# EAGLE schematic MCAT-CANYVAL-BPL-5X1 (EAGLE 7.2.0)
DATECODE: 20150302102847; REV: 5X
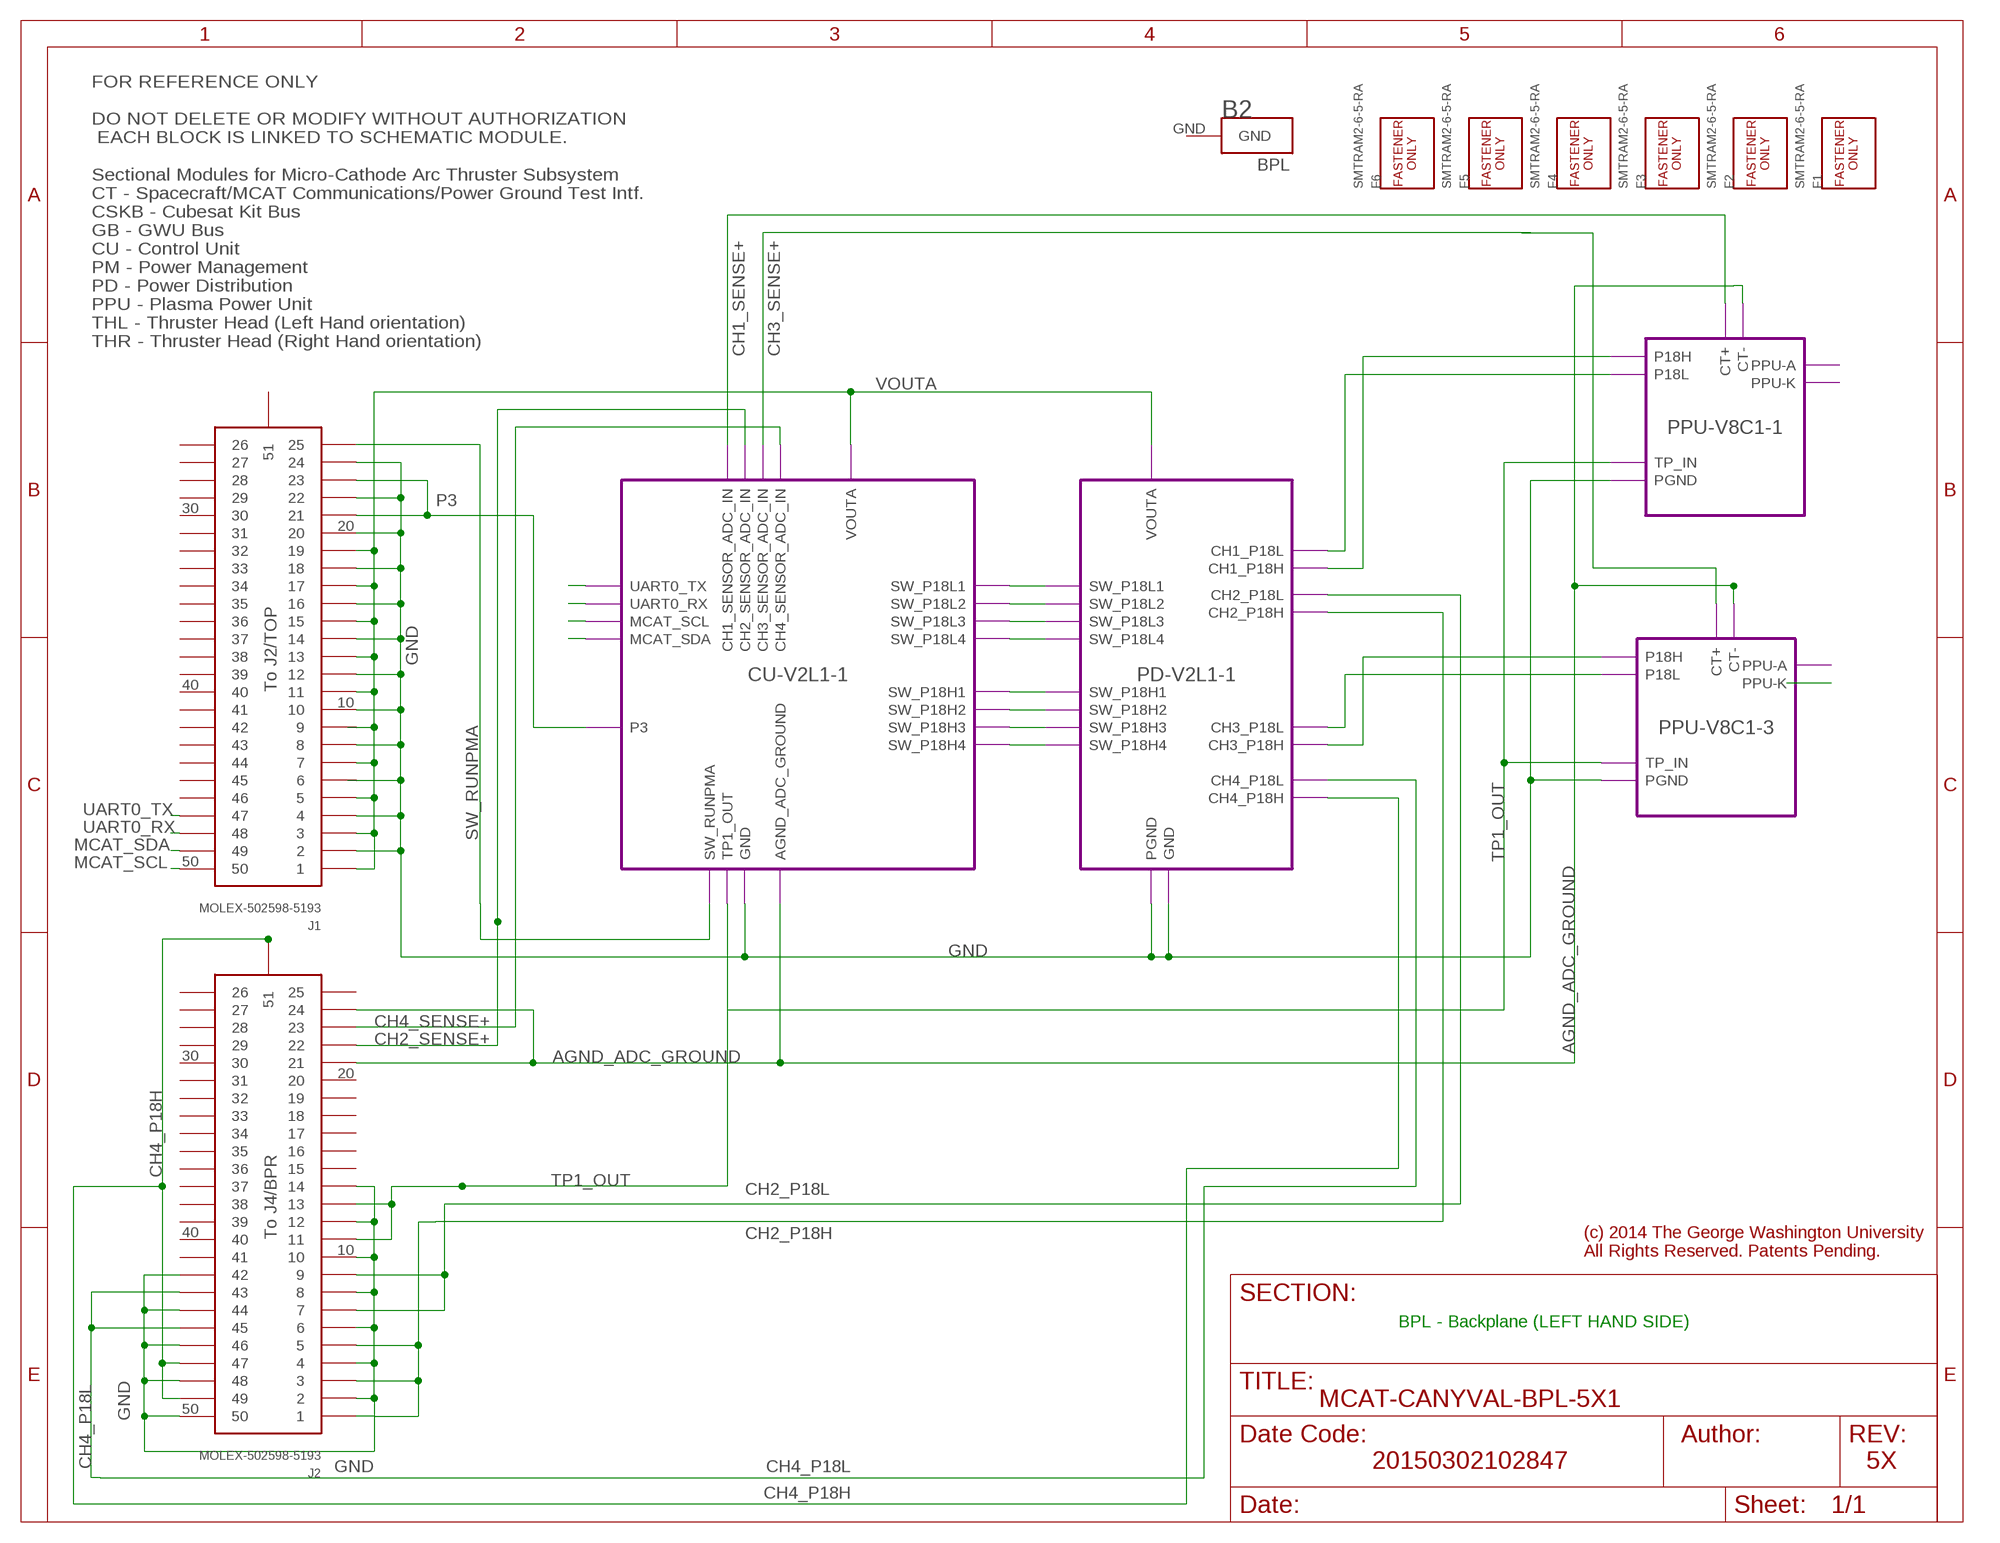
[diagram p0: schematic, sheet 1]

## Parts
B2  MCAT-4CU-C-PCB/BPL  [MCAT-4CU-C-BPL-V4-BLANK]
F1  SMTRAM2-6-5-RA  [SMTRA-M2-6-5-RA]
F2  SMTRAM2-6-5-RA  [SMTRA-M2-6-5-RA]
F3  SMTRAM2-6-5-RA  [SMTRA-M2-6-5-RA]
F4  SMTRAM2-6-5-RA  [SMTRA-M2-6-5-RA]
F5  SMTRAM2-6-5-RA  [SMTRA-M2-6-5-RA]
F6  SMTRAM2-6-5-RA  [SMTRA-M2-6-5-RA]
J1  MOLEX-502598-5193  [MOLEX-502598-5193]
J2  MOLEX-502598-5193  [MOLEX-502598-5193]

## Module instances
PD-V2L1-1 = PD-V2L1
CU-V2L1-1 = CU-V2L2
PPU-V8C1-1 = PPU-V8C1
PPU-V8C1-3 = PPU-V8C1

## Nets
AGND_ADC_GROUND: J2.21 J2.24 ; port PPU-V8C1-1.CT- PPU-V8C1-3.CT- CU-V2L1-1.AGND_ADC_GROUND
CH1_P18H [P18H-0.6A-CKT]: port PD-V2L1-1.CH1_P18H PPU-V8C1-1.P18H
CH1_P18L: port PD-V2L1-1.CH1_P18L PPU-V8C1-1.P18L
CH1_SENSE+: port PPU-V8C1-1.CT+ CU-V2L1-1.CH1_SENSOR_ADC_IN
CH2_P18H [P18H-0.6A-CKT]: J2.1 J2.3 J2.5 ; port PD-V2L1-1.CH2_P18H
CH2_P18L: J2.7 J2.9 ; port PD-V2L1-1.CH2_P18L
CH2_SENSE+: J2.22 ; port CU-V2L1-1.CH2_SENSOR_ADC_IN
CH3_P18H [P18H-0.6A-CKT]: port PD-V2L1-1.CH3_P18H PPU-V8C1-3.P18H
CH3_P18L: port PD-V2L1-1.CH3_P18L PPU-V8C1-3.P18L
CH3_SENSE+: port CU-V2L1-1.CH3_SENSOR_ADC_IN PPU-V8C1-3.CT+
CH4_P18H: J2.47 J2.49 J2.51 ; port PD-V2L1-1.CH4_P18H
CH4_P18L: J2.43 J2.45 ; port PD-V2L1-1.CH4_P18L
CH4_SENSE+: J2.23 ; port CU-V2L1-1.CH4_SENSOR_ADC_IN
CH13_PPU_K: port PPU-V8C1-3.PPU-K
GND: J1.2 J1.4 J1.8 J1.10 J1.12 J1.14 J1.16 J1.18 J1.20 J1.22 J1.24 J2.2 J2.4 J2.6 J2.8 J2.10 J2.12 J2.14 J2.42 J2.44 J2.46 J2.48 J2.50 ; port PD-V2L1-1.GND PD-V2L1-1.PGND PPU-V8C1-1.PGND PPU-V8C1-3.PGND CU-V2L1-1.GND
MCAT_SCL: J1.50 ; port CU-V2L1-1.MCAT_SCL
MCAT_SDA: J1.49 ; port CU-V2L1-1.MCAT_SDA
N$3: port PPU-V8C1-1.PPU-K
N$24: port CU-V2L1-1.SW_P18H3 PD-V2L1-1.SW_P18H3
P3 [P3-0.5A-CKT]: J1.21 J1.23 ; port CU-V2L1-1.P3
SW_P18H1: port CU-V2L1-1.SW_P18H1 PD-V2L1-1.SW_P18H1
SW_P18H3: port CU-V2L1-1.SW_P18H2 PD-V2L1-1.SW_P18H2
SW_P18H4: port CU-V2L1-1.SW_P18H4 PD-V2L1-1.SW_P18H4
SW_P18L: port CU-V2L1-1.SW_P18L1 PD-V2L1-1.SW_P18L1
SW_P18L2: port CU-V2L1-1.SW_P18L2 PD-V2L1-1.SW_P18L2
SW_P18L3: port CU-V2L1-1.SW_P18L3 PD-V2L1-1.SW_P18L3
SW_P18L4: port CU-V2L1-1.SW_P18L4 PD-V2L1-1.SW_P18L4
SW_RUNPMA: J1.25 ; port CU-V2L1-1.SW_RUNPMA
TP1_OUT [P18H-0.6A-CKT]: J2.11 J2.13 ; port CU-V2L1-1.TP1_OUT PPU-V8C1-3.TP_IN PPU-V8C1-1.TP_IN
UART0_RX: J1.48 ; port CU-V2L1-1.UART0_RX
UART0_TX: J1.47 ; port CU-V2L1-1.UART0_TX
VOUTA [VOUTA-2A-CKT]: J1.1 J1.3 J1.5 J1.7 J1.11 J1.13 J1.15 J1.17 J1.19 ; port PD-V2L1-1.VOUTA CU-V2L1-1.VOUTA
Unconnected: B2.GND J1.6 J1.9 J1.26 J1.27 J1.28 J1.29 J1.30 J1.31 J1.32 J1.33 J1.34 J1.35 J1.36 J1.37 J1.38 J1.39 J1.40 J1.41 J1.42 J1.43 J1.44 J1.45 J1.46 J1.51 J2.15 J2.16 J2.17 J2.18 J2.19 J2.20 J2.25 J2.26 J2.27 J2.28 J2.29 J2.30 J2.31 J2.32 J2.33 J2.34 J2.35 J2.36 J2.37 J2.38 J2.39 J2.40 J2.41

## Notes on the sheet
- FOR REFERENCE ONLY
  
  DO NOT DELETE OR MODIFY WITHOUT AUTHORIZATION
   EACH BLOCK IS LINKED TO SCHEMATIC MODULE.
  
  Sectional Modules for Micro-Cathode Arc Thruster Subsystem
  CT - Spacecraft/MCAT Communications/Power Ground Test Intf.
  CSKB - Cubesat Kit Bus
  GB - GWU Bus
  CU - Control Unit
  PM - Power Management
  PD - Power Distribution
  PPU - Plasma Power Unit
  THL - Thruster Head (Left Hand orientation)
  THR - Thruster Head (Right Hand orientation)
- To J2/TOP
- To J4/BPR
- BPL - Backplane (LEFT HAND SIDE)

## Library data of the parts
B2 = gwu_mpnl_ucat_v10:MCAT-4CU-C-PCB; COPYRIGHT: (c) 2015, The George Washington University. All Rights Reserved.; PCBLABEL: BPL
F1-F6 = gwu_mpnl_ucat_v10:SMTRA: Type SMTRA - ReelFast Surface Mount Right Angle (R'ANGLE) Fastener (Metric); MF: PENNEngineering; MPN: SMTRAM2-6-5ET
J1 J2 = gwu_mpnl_ucat_v10:MOLEX-502598-5193: MOLEX 0.3MM PITCH FPC CONN MALE 51 CKTS MOLEX 502598-5193 based upon SD-502598-003 (2012/08/01); MF: MOLEX; MPN: 502598-5193

## Module CU-V2L2
Ports: GND(pwr) P3(in) UART0_TX(out) UART0_RX(in) SW_RUNPMA(out) TP1_OUT(out) SW_P18L1(out) SW_P18L2(out) SW_P18L3(out) SW_P18L4(out) SW_P18H1(out) SW_P18H2(out) SW_P18H3(out) SW_P18H4(out) CH1_SENSOR_ADC_IN(io) CH2_SENSOR_ADC_IN(io) CH3_SENSOR_ADC_IN(io) CH4_SENSOR_ADC_IN(io) AGND_ADC_GROUND(io) MCAT_SCL(io) MCAT_SDA(io) VOUTA(io)
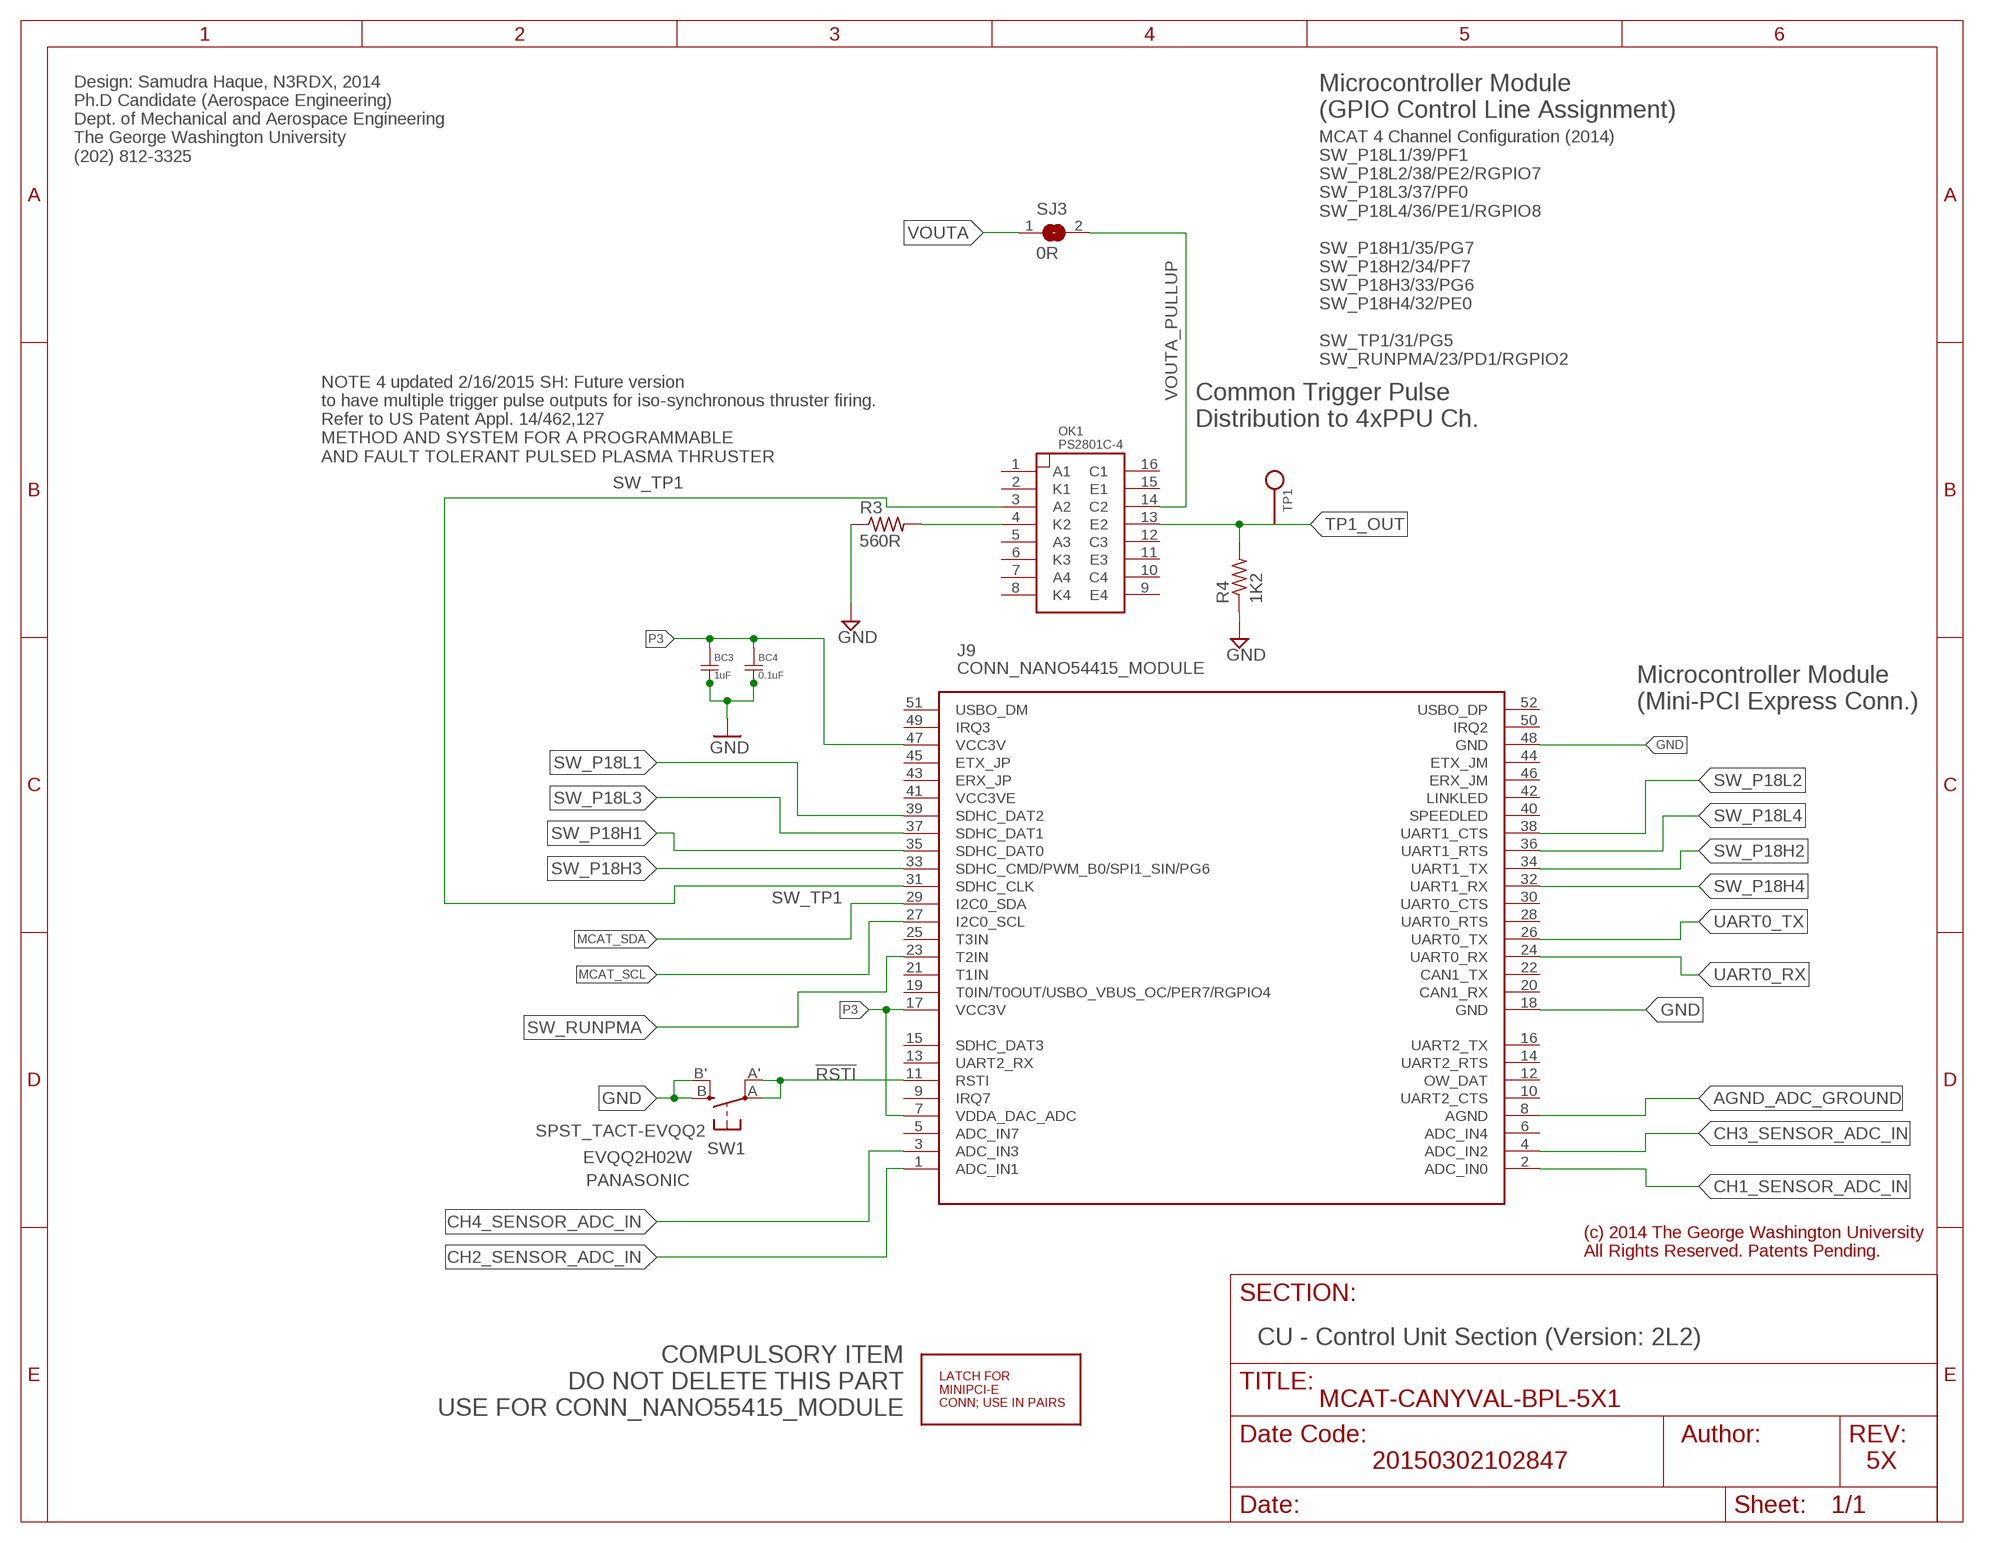
[diagram p1: schematic, module CU-V2L2, sheet 1]

### Parts
BC3  BYPASS-CAP-1UF  [0612-REV]
BC4  BYPASS-CAP-0.1UF  [0612-REV]
J7  LATCH_NANO54415_MODULE  [LATCH_SD-48099-400]
J9  CONN_NANO54415_MODULE  [CONN_SD-67910-001]
OK1  PS2801C-4  [SSOP(16PIN)]
R3  560R  R-US_R0805  [R0805]
R4  1K2  R-US_R0805  [R0805]
SJ3  0R  SJ  [SJ]
SW1  SPST_TACT-EVQQ2  [EVQ-Q2]
TP1  PCB-MINI-SMD-TESTPOINT/SQ  [PCB-MINI-SMD-TESTPOINT]

### Nets
!RSTI: J9.11(RSTI) SW1.A'(P1) SW1.A(P)
AGND_ADC_GROUND: J9.8(AGND)
CH1_SENSOR_ADC_IN: J9.2(ADC_IN0)
CH2_SENSOR_ADC_IN: J9.1(ADC_IN1)
CH3_SENSOR_ADC_IN: J9.4(ADC_IN2)
CH4_SENSOR_ADC_IN: J9.3(ADC_IN3)
GND: BC3.2 BC4.2 J9.18(GND) J9.48(GND) R3.1 R4.1 SW1.B'(S1) SW1.B(S)
MCAT_SCL: J9.27(I2C0_SCL)
MCAT_SDA: J9.29(I2C0_SDA)
P3 [P3-0.5A-CKT]: BC3.1 BC4.1 J9.7(VDDA_DAC_ADC) J9.17(VCC3V) J9.47(VCC3V)
SW1_TP1_RTN: OK1.4(K2) R3.2
SW_P18H1: J9.35(SDHC_DAT0)
SW_P18H2: J9.34(UART1_TX)
SW_P18H3: J9.33(SDHC_CMD/PWM_B0/SPI1_SIN/PG6)
SW_P18H4: J9.32(UART1_RX)
SW_P18L1: J9.39(SDHC_DAT2)
SW_P18L2: J9.38(UART1_CTS)
SW_P18L3: J9.37(SDHC_DAT1)
SW_P18L4: J9.36(UART1_RTS)
SW_RUNPMA: J9.23(T2IN)
SW_TP1: J9.31(SDHC_CLK) OK1.3(A2)
TP1_OUT [P18H-0.6A-CKT]: OK1.13(E2) R4.2 TP1.1(TP)
UART0_RX: J9.24(UART0_RX)
UART0_TX: J9.26(UART0_TX)
VOUTA [power]: SJ3.1
VOUTA_PULLUP [P18H-0.6A-CKT]: OK1.14(C2) SJ3.2
Unconnected: J9.5(ADC_IN7) J9.6(ADC_IN4) J9.9(IRQ7) J9.10(UART2_CTS) J9.12(OW_DAT) J9.13(UART2_RX) J9.14(UART2_RTS) J9.15(SDHC_DAT3) J9.16(UART2_TX) J9.19(T0IN/T0OUT/USBO_VBUS_OC/PER7/RGPIO4) J9.20(CAN1_RX) J9.21(T1IN) J9.22(CAN1_TX) J9.25(T3IN) J9.28(UART0_RTS) J9.30(UART0_CTS) J9.40(SPEEDLED) J9.41(VCC3VE) J9.42(LINKLED) J9.43(ERX_JP) J9.44(ETX_JM) J9.45(ETX_JP) J9.46(ERX_JM) J9.49(IRQ3) J9.50(IRQ2) J9.51(USBO_DM) J9.52(USBO_DP) OK1.1(A1) OK1.2(K1) OK1.5(A3) OK1.6(K3) OK1.7(A4) OK1.8(K4) OK1.9(E4) OK1.10(C4) OK1.11(E3) OK1.12(C3) OK1.15(E1) OK1.16(C1)

### Notes on the sheet
- Microcontroller Module
  (GPIO Control Line Assignment)
- Design: Samudra Haque, N3RDX, 2014
  Ph.D Candidate (Aerospace Engineering)
  Dept. of Mechanical and Aerospace Engineering
  The George Washington University
  (202) 812-3325
- MCAT 4 Channel Configuration (2014)
  SW_P18L1/39/PF1
  SW_P18L2/38/PE2/RGPIO7
  SW_P18L3/37/PF0
  SW_P18L4/36/PE1/RGPIO8
  
  SW_P18H1/35/PG7
  SW_P18H2/34/PF7
  SW_P18H3/33/PG6
  SW_P18H4/32/PE0
  
  SW_TP1/31/PG5
  SW_RUNPMA/23/PD1/RGPIO2
- Common Trigger Pulse
  Distribution to 4xPPU Ch.
- NOTE 4 updated 2/16/2015 SH: Future version
  to have multiple trigger pulse outputs for iso-synchronous thruster firing. 
  Refer to US Patent Appl. 14/462,127 
  METHOD AND SYSTEM FOR A PROGRAMMABLE 
  AND FAULT TOLERANT PULSED PLASMA THRUSTER
- Microcontroller Module
  (Mini-PCI Express Conn.)
- CU - Control Unit Section (Version: 2L2)
- COMPULSORY ITEM
  DO NOT DELETE THIS PART
  USE FOR CONN_NANO55415_MODULE

### Library data of the parts
BC3 = gwu_mpnl_ucat_v10:BYPASS-CAP-1UF; MF: AVX; MPN: 0612YC105KAT2A
BC4 = gwu_mpnl_ucat_v10:BYPASS-CAP-0.1UF; MF: AVX; MPN: 06123C104KAT2A
J7 = gwu_mpnl_ucat_v10:LATCH_NANO54415_MODULE; MF: MOLEX; MPN: SD-48099-400
J9 = gwu_mpnl_ucat_v10:CONN_NANO54415_MODULE; MF: MOLEX; MPN: SD-679101-002
OK1 = gwu_mpnl_ucat_v10:PS2801C-4; MF: CEL/California Eastern Laboratories; MPN: PS2801C-4-F3-A
R3 = resistor:R-US_: RESISTOR, American symbol; MF: PANASONIC; MPN: ERA-6AEB561V
R4 = resistor:R-US_: RESISTOR, American symbol; MF: PANASONIC; MPN: ERA-6AEB122V
SJ3 = jumper:SJ: SMD solder JUMPER; MF: VISHAY/DALE; MPN: CRCW08050000Z0EA
SW1 = adafruit:SPST_TACT: SMT 6mm switch, EVQQ2 series http://www.ladyada.net/library/eagle; MF: PANASONIC; MPN: EVQQ2H02W
TP1 = gwu_mpnl_ucat_v10:PCB-MINI-SMD-TESTPOINT; MF: Keystone Electronics; MPN: 5015

## Module PD-V2L1
Ports: VOUTA(in) GND(pwr) SW_P18L1(in) SW_P18L2(in) SW_P18L3(in) SW_P18L4(in) SW_P18H1(in) SW_P18H2(in) SW_P18H3(in) SW_P18H4(in) CH1_P18L(out) CH1_P18H(out) CH2_P18L(out) CH2_P18H(out) CH3_P18L(out) CH3_P18H(out) CH4_P18L(out) CH4_P18H(out) PGND(pwr)
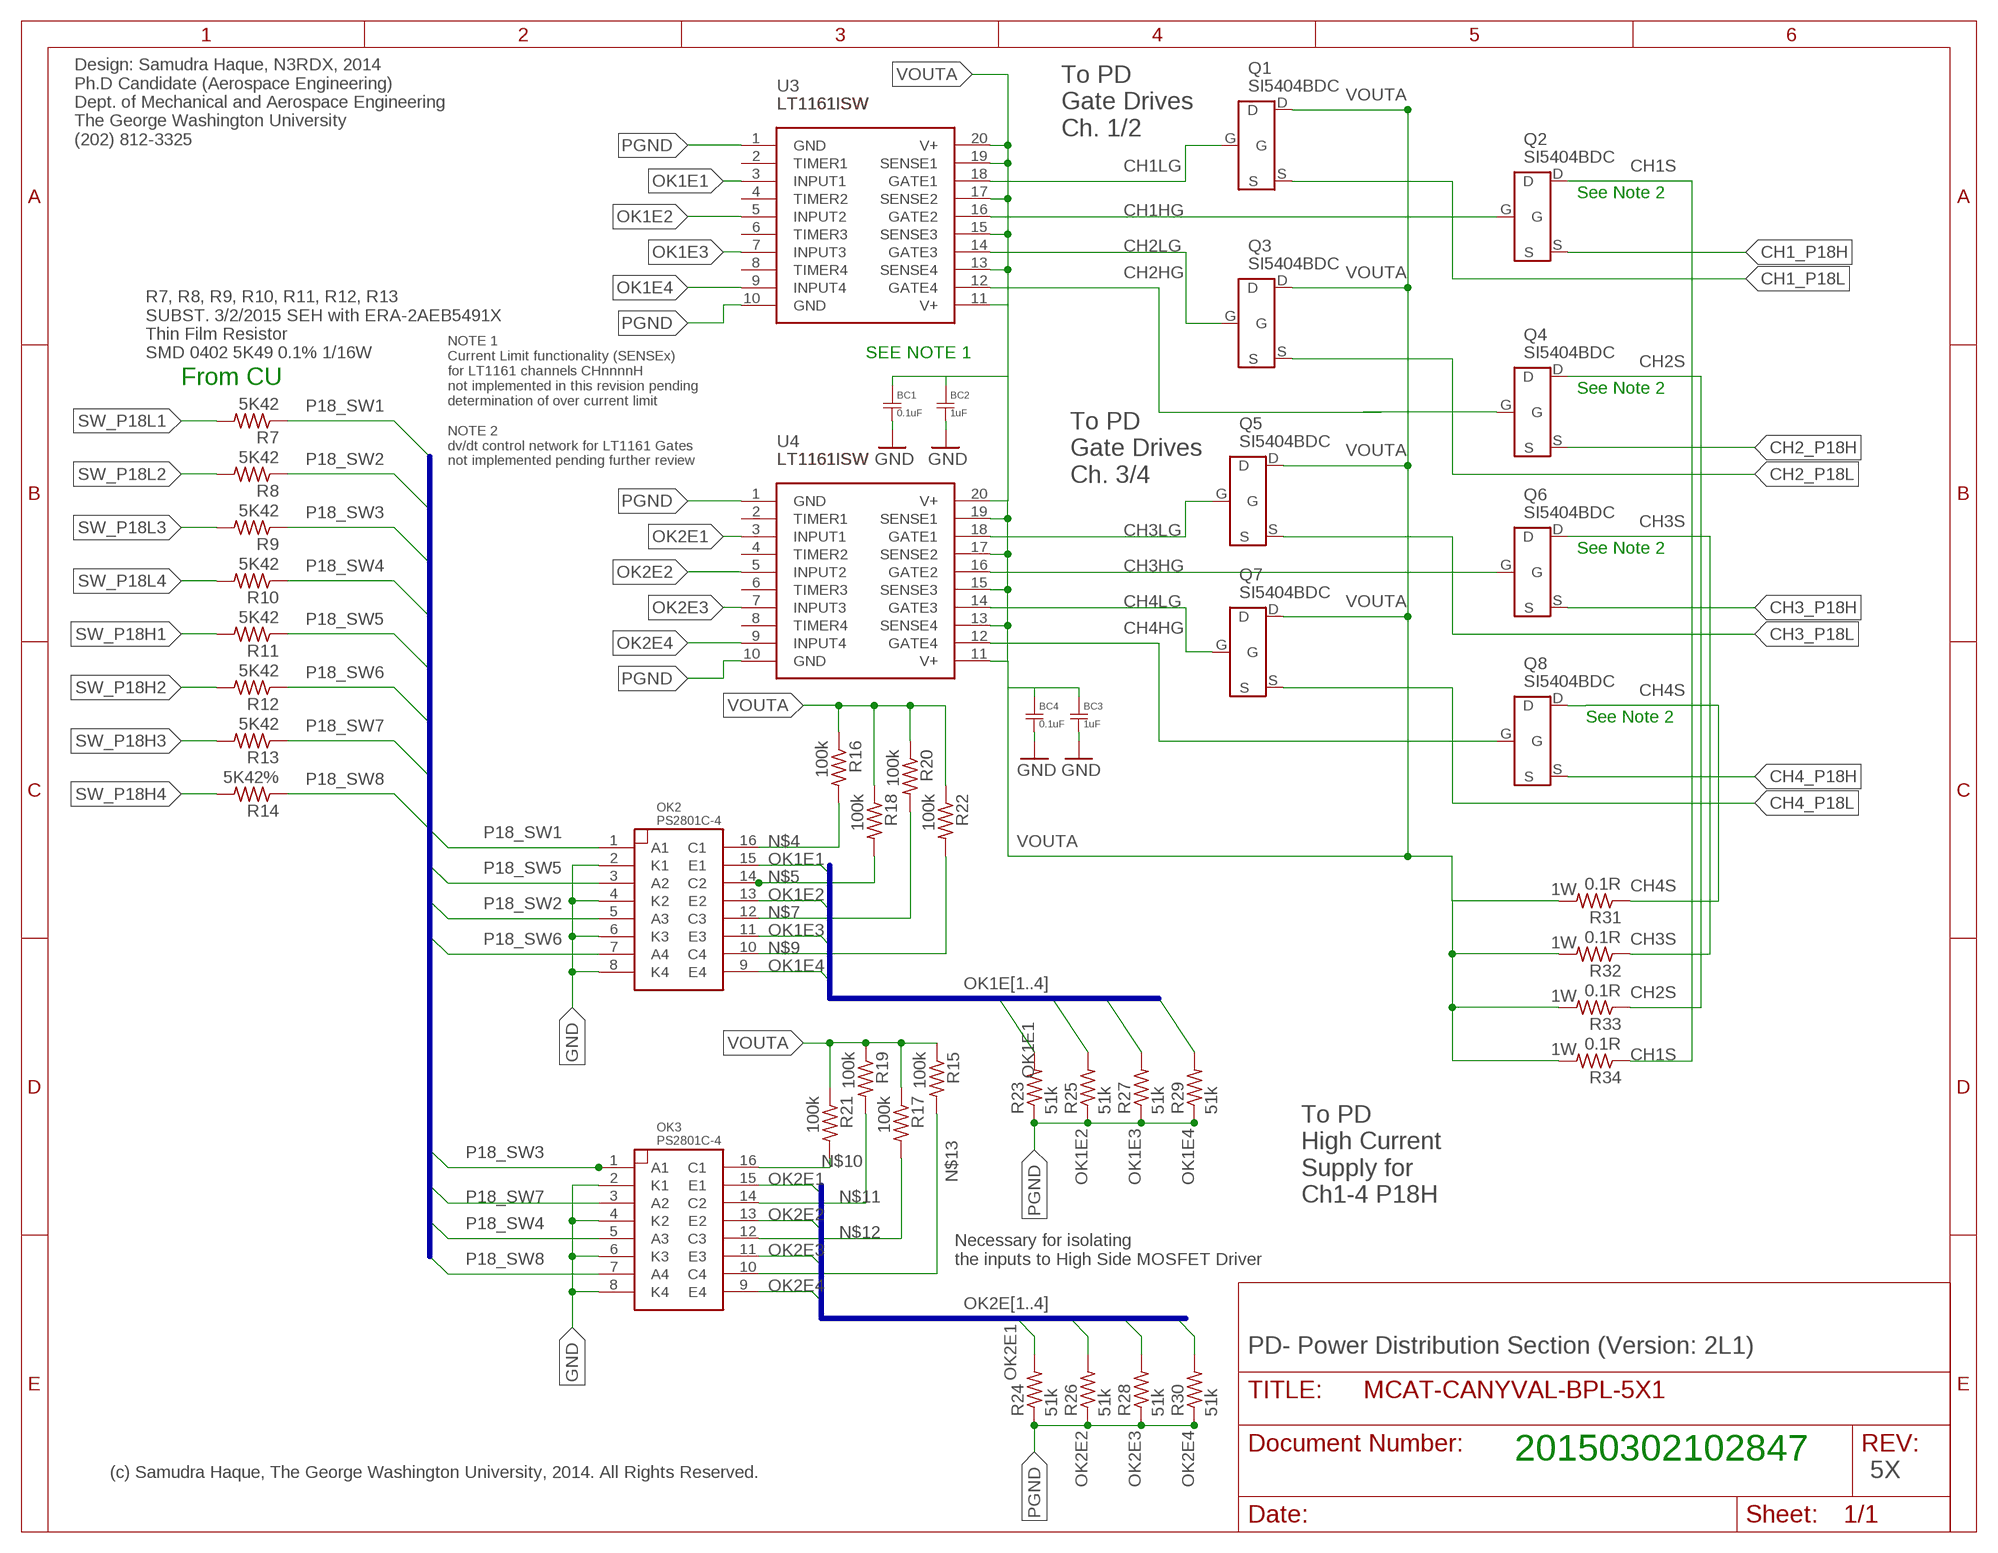
[diagram p2: schematic, module PD-V2L1, sheet 1]

### Parts
BC1  BYPASS-CAP-0.1UF  [0612-REV]
BC2  BYPASS-CAP-1UF  [0612-REV]
BC3  BYPASS-CAP-1UF  [0612-REV]
BC4  BYPASS-CAP-0.1UF  [0612-REV]
OK2  PS2801C-4  [SSOP(16PIN)]
OK3  PS2801C-4  [SSOP(16PIN)]
Q1  SI5404BDC  [1206-8-CHIPFET]
Q2  SI5404BDC  [1206-8-CHIPFET]
Q3  SI5404BDC  [1206-8-CHIPFET]
Q4  SI5404BDC  [1206-8-CHIPFET]
Q5  SI5404BDC  [1206-8-CHIPFET]
Q6  SI5404BDC  [1206-8-CHIPFET]
Q7  SI5404BDC  [1206-8-CHIPFET]
Q8  SI5404BDC  [1206-8-CHIPFET]
R7  5K42  R-US_R0402  [R0402]
R8  5K42  R-US_R0402  [R0402]
R9  5K42  R-US_R0402  [R0402]
R10  5K42  R-US_R0402  [R0402]
R11  5K42  R-US_R0402  [R0402]
R12  5K42  R-US_R0402  [R0402]
R13  5K42  R-US_R0402  [R0402]
R14  5K42%  R-US_R0402  [R0402]
R15  100k  R-US_R0402  [R0402]
R16  100k  R-US_R0402  [R0402]
R17  100k  R-US_R0402  [R0402]
R18  100k  R-US_R0402  [R0402]
R19  100k  R-US_R0402  [R0402]
R20  100k  R-US_R0402  [R0402]
R21  100k  R-US_R0402  [R0402]
R22  100k  R-US_R0402  [R0402]
R23  51k  R-US_R0402  [R0402]
R24  51k  R-US_R0402  [R0402]
R25  51k  R-US_R0402  [R0402]
R26  51k  R-US_R0402  [R0402]
R27  51k  R-US_R0402  [R0402]
R28  51k  R-US_R0402  [R0402]
R29  51k  R-US_R0402  [R0402]
R30  51k  R-US_R0402  [R0402]
R31  0.1R  R-US_R1206  [R1206]
R32  0.1R  R-US_R1206  [R1206]
R33  0.1R  R-US_R1206  [R1206]
R34  0.1R  R-US_R1206  [R1206]
U3  LT1161ISW  [20-LEAD-PLASTIC-SO]
U4  LT1161ISW  [20-LEAD-PLASTIC-SO]

### Nets
CH1_P18H [power]: Q2.S
CH1_P18L: Q1.S
CH1HG: Q2.G U3.16(GATE2)
CH1LG: Q1.G U3.18(GATE1)
CH1S: Q2.D R34.1
CH2_P18H [power]: Q4.S
CH2_P18L: Q3.S
CH2HG: Q4.G U3.12(GATE4)
CH2LG: Q3.G U3.14(GATE3)
CH2S: Q4.D R33.1
CH3_P18H [power]: Q6.S
CH3_P18L: Q5.S
CH3HG: Q6.G U4.16(GATE2)
CH3LG: Q5.G U4.18(GATE1)
CH3S: Q6.D R32.1
CH4_P18H [power]: Q8.S
CH4_P18L: Q7.S
CH4HG: Q8.G U4.12(GATE4)
CH4LG: Q7.G U4.14(GATE3)
CH4S: Q8.D R31.1
GND: BC1.2 BC2.2 BC3.2 BC4.2 OK2.2(K1) OK2.4(K2) OK2.6(K3) OK2.8(K4) OK3.2(K1) OK3.4(K2) OK3.6(K3) OK3.8(K4)
N$4: OK2.16(C1) R16.2
N$5: OK2.14(C2) R18.2
N$7: OK2.12(C3) R20.2
N$9: OK2.10(C4) R22.2
N$10: OK3.16(C1) R21.2
N$11: OK3.14(C2) R19.2
N$12: OK3.12(C3) R17.2
N$13: OK3.10(C4) R15.2
OK1E1: OK2.15(E1) R23.2 U3.3(INPUT1)
OK1E2: OK2.13(E2) R25.2 U3.5(INPUT2)
OK1E3: OK2.11(E3) R27.2 U3.7(INPUT3)
OK1E4: OK2.9(E4) R29.2 U3.9(INPUT4)
OK2E1: OK3.15(E1) R24.2 U4.3(INPUT1)
OK2E2: OK3.13(E2) R26.2 U4.5(INPUT2)
OK2E3: OK3.11(E3) R28.2 U4.7(INPUT3)
OK2E4: OK3.9(E4) R30.2 U4.9(INPUT4)
P18_SW1: OK2.1(A1) R7.1
P18_SW2: OK2.5(A3) R8.1
P18_SW3: OK3.1(A1) R9.1
P18_SW4: OK3.5(A3) R10.1
P18_SW5: OK2.3(A2) R11.1
P18_SW6: OK2.7(A4) R12.1
P18_SW7: OK3.3(A2) R13.1
P18_SW8: OK3.7(A4) R14.1
PGND: R23.1 R24.1 R25.1 R26.1 R27.1 R28.1 R29.1 R30.1 U3.1(GND) U3.10(GND) U4.1(GND) U4.10(GND)
SW_P18H1: R11.2
SW_P18H2: R12.2
SW_P18H3: R13.2
SW_P18H4: R14.2
SW_P18L1: R7.2
SW_P18L2: R8.2
SW_P18L3: R9.2
SW_P18L4: R10.2
VOUTA [power]: BC1.1 BC2.1 BC3.1 BC4.1 Q1.D Q3.D Q5.D Q7.D R15.1 R16.1 R17.1 R18.1 R19.1 R20.1 R21.1 R22.1 R31.2 R32.2 R33.2 R34.2 U3.11(V+) U3.13(SENSE4) U3.15(SENSE3) U3.17(SENSE2) U3.19(SENSE1) U3.20(V+) U4.11(V+) U4.13(SENSE4) U4.15(SENSE3) U4.17(SENSE2) U4.19(SENSE1) U4.20(V+)
Unconnected: U3.2(TIMER1) U3.4(TIMER2) U3.6(TIMER3) U3.8(TIMER4) U4.2(TIMER1) U4.4(TIMER2) U4.6(TIMER3) U4.8(TIMER4)

### Buses
P18_SW[1..8]
OK1E[1..4]
OK2E[1..4]

### Notes on the sheet
- To PD
  Gate Drives
  Ch. 1/2
- Design: Samudra Haque, N3RDX, 2014
  Ph.D Candidate (Aerospace Engineering)
  Dept. of Mechanical and Aerospace Engineering
  The George Washington University
  (202) 812-3325
- See Note 2
- R7, R8, R9, R10, R11, R12, R13 
  SUBST. 3/2/2015 SEH with ERA-2AEB5491X
  Thin Film Resistor 
  SMD 0402 5K49 0.1% 1/16W
- SEE NOTE 1
- From CU
- See Note 2
- NOTE 1 
  Current Limit functionality (SENSEx)
  for LT1161 channels CHnnnnH
  not implemented in this revision pending
  determination of over current limit
  
  NOTE 2
  dv/dt control network for LT1161 Gates
  not implemented pending further review
- To PD
  Gate Drives
  Ch. 3/4
- See Note 2
- See Note 2
- To PD
  High Current
  Supply for
  Ch1-4 P18H
- Necessary for isolating 
  the inputs to High Side MOSFET Driver
- PD- Power Distribution Section (Version: 2L1)
- (c) Samudra Haque, The George Washington University, 2014. All Rights Reserved.

### Library data of the parts
BC1 BC4 = gwu_mpnl_ucat_v10:BYPASS-CAP-0.1UF; MF: AVX; MPN: 06123C104KAT2A
BC2 BC3 = gwu_mpnl_ucat_v10:BYPASS-CAP-1UF; MF: AVX; MPN: 0612YC105KAT2A
OK2 OK3 = gwu_mpnl_ucat_v10:PS2801C-4; MF: CEL/California Eastern Laboratories; MPN: PS2801C-4-F3-A
Q1-Q8 = gwu_mpnl_ucat_v10:SI5404BDC; MF: VISHAY/SILICONIX; MPN: SI5404BDC-T1-E3
R7-R14 = resistor:R-US_: RESISTOR, American symbol; MF: KOA Speer; MPN: RN73H1ETTP5421B10
R15-R22 = resistor:R-US_: RESISTOR, American symbol; MF: YAGEO; MPN: RT0402BRD07100KL
R23-R30 = resistor:R-US_: RESISTOR, American symbol; MF: SUSUMU; MPN: RG1005N-513-B-T5
R31-R34 = rcl:R-US_: RESISTOR, American symbol; MF: SUSUMU; MPN: PRL1632-R100-F-T1; RATING: 1W
U3 U4 = gwu_mpnl_ucat_v10:LT1161; MF: LINEAR; MPN: LT1161ISW#TRPBF

## Module PPU-V8C1
Ports: PGND(pwr) P18L(in) P18H(in) TP_IN(in) CT+(io) CT-(io) PPU-A(io) PPU-K(io)
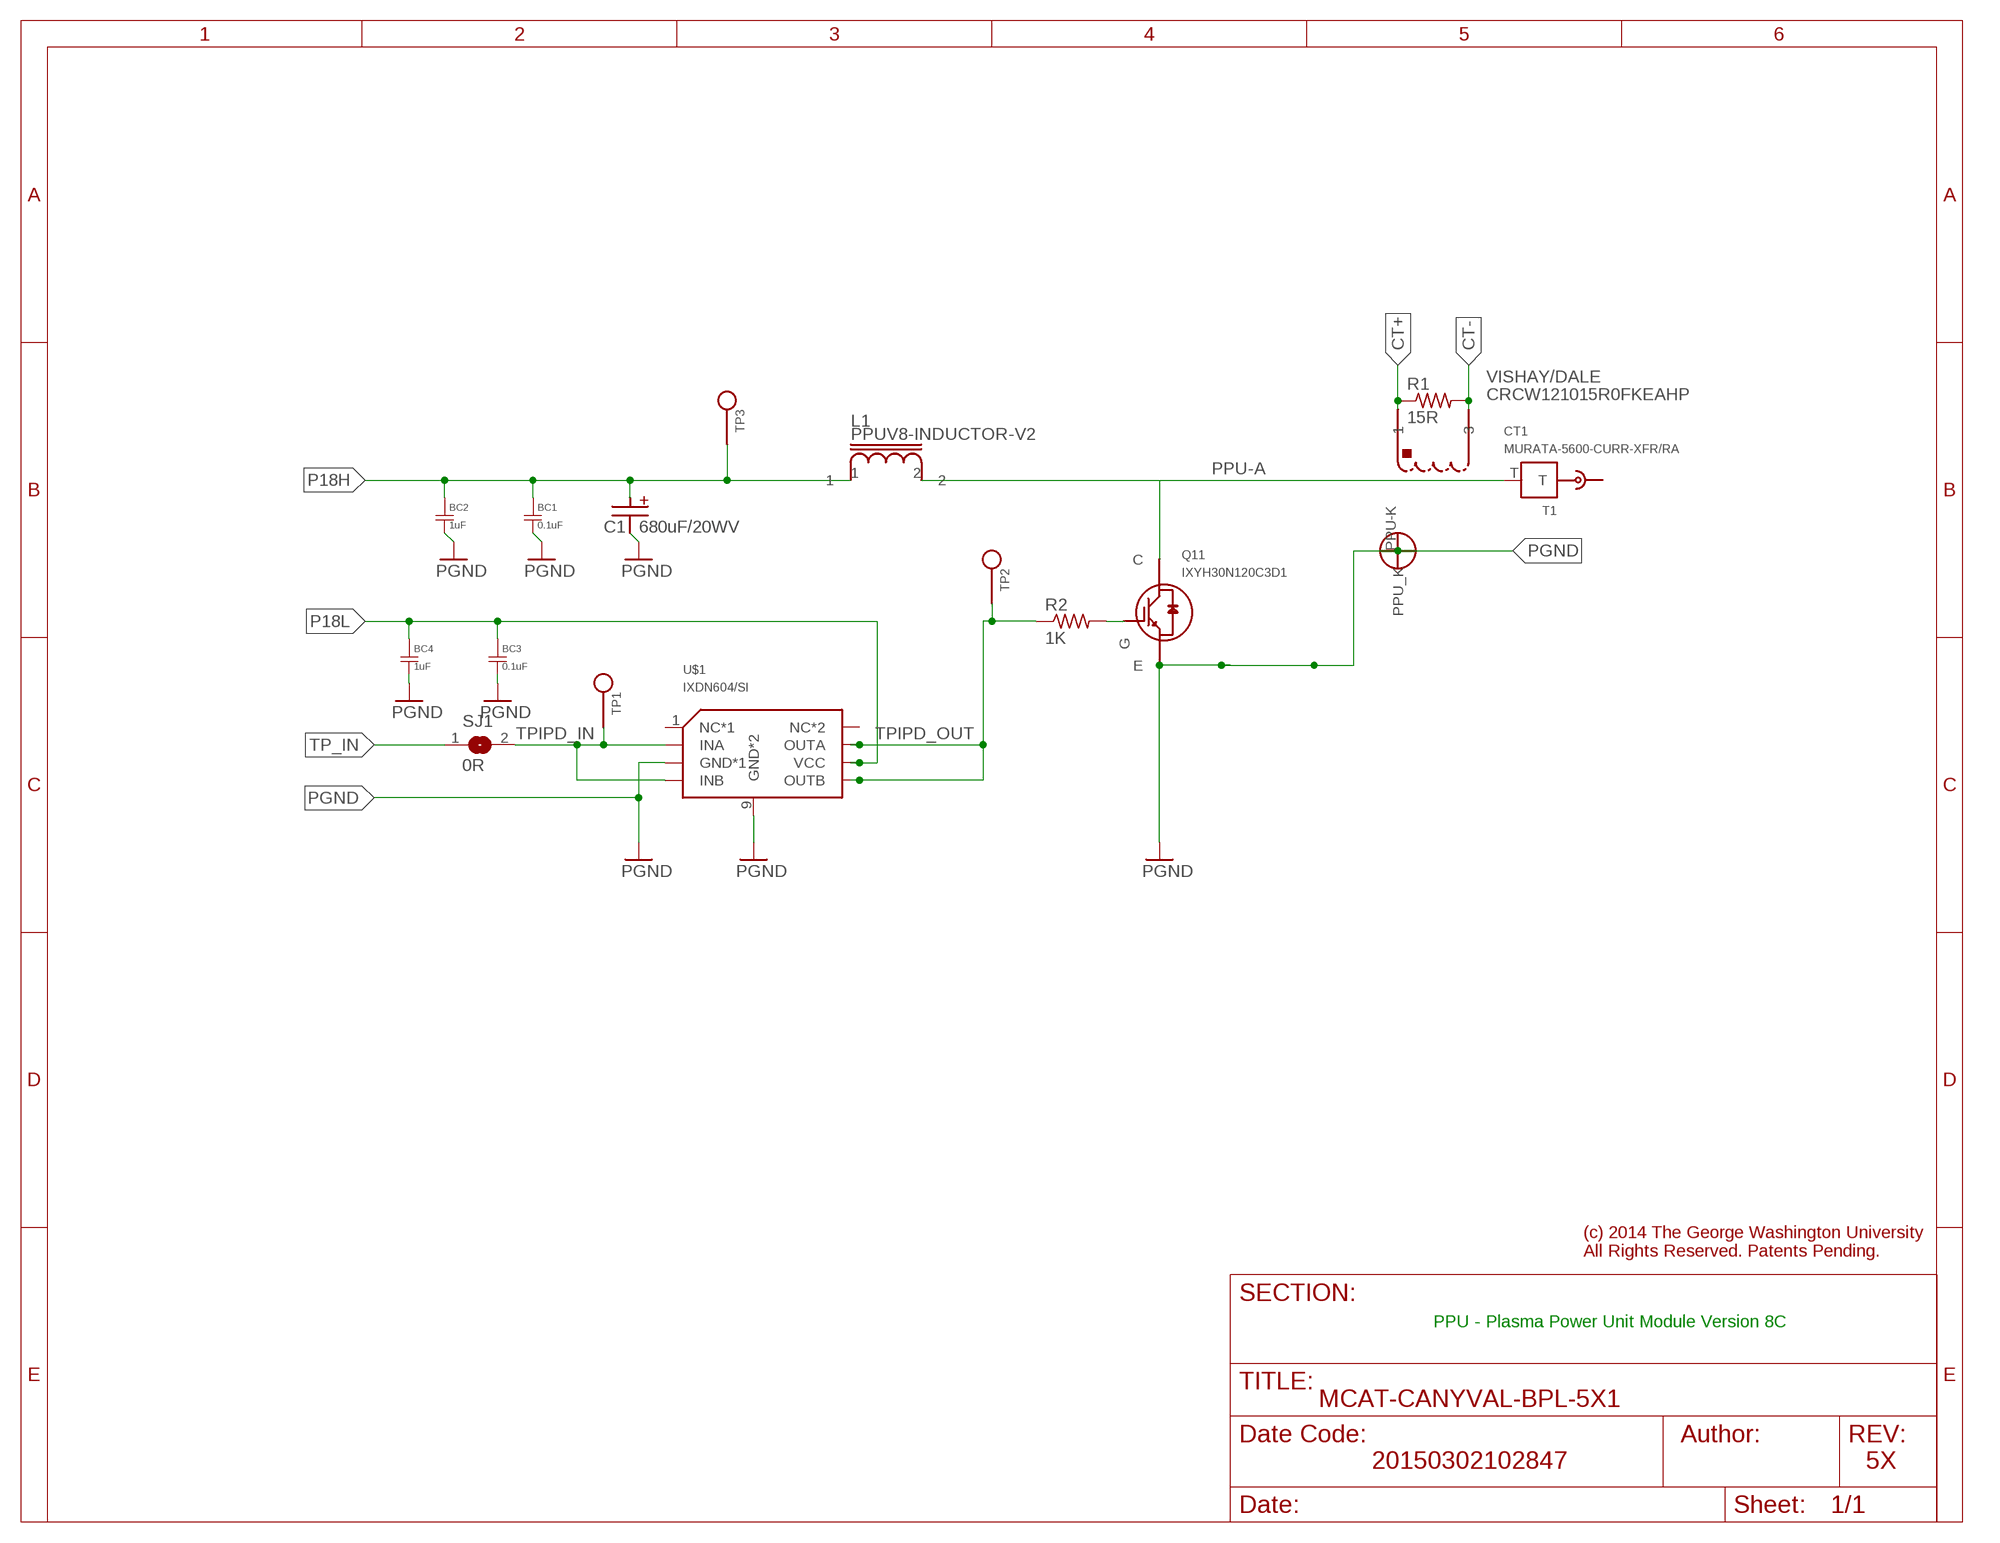
[diagram p3: schematic, module PPU-V8C1, sheet 1]

### Parts
BC1  BYPASS-CAP-0.1UF  [0612-REV]
BC2  BYPASS-CAP-1UF  [0612-REV]
BC3  BYPASS-CAP-0.1UF  [0612-REV]
BC4  BYPASS-CAP-1UF  [0612-REV]
C1  680uF/20WV  APSG200ELL681MJB5S  [CHEMI-CON-PSG-JB5]
CT1  MURATA-5600-CURR-XFR/RA  [MURATA-5600-SERIES-CURR-XFR-RA]
L1  PPUV8-INDUCTOR-V2  [PPUV8-INDUCTOR-V2]
Q11  IXYH30N120C3D1  IXYH30N120C3D1/V  [IXYS-TO-247-AD-VERT]
R1  15R  R-US_R1210  [R1210]
R2  1K  R-US_R0805  [R0805]
SJ1  0R  SJ  [SJ]
T1  MCAT-SPADE-TERMINAL  [SPADE-TERMINAL-FLANGED-NYLON-INSULATED]
TP1  PCB-MINI-SMD-TESTPOINT/SQ  [PCB-MINI-SMD-TESTPOINT]
TP2  PCB-MINI-SMD-TESTPOINT/SQ  [PCB-MINI-SMD-TESTPOINT]
TP3  PCB-MINI-SMD-TESTPOINT/SQ  [PCB-MINI-SMD-TESTPOINT]
U$1  IXDN604/SI  [IXYS-SI-8PIN-POWER-SOIC]

### Nets
CT+: CT1.1 R1.1
CT-: CT1.3 R1.2
N$2: Q11.G R2.2
P18H [power]: BC1.1 BC2.1 C1.POS(CAP_POS) L1.1 TP3.1(TP)
P18L: BC3.1 BC4.1 U$1.6(VCC)
PGND: BC1.2 BC2.2 BC3.2 BC4.2 C1.NEG(CAP_NEG) CT1.PPU-K(PPU_K) Q11.E U$1.3(GND*1) U$1.9(GND*2)
PPU-A: L1.2 Q11.C T1.T
TP_IN: SJ1.1
TPIPD_IN: SJ1.2 TP1.1(TP) U$1.2(INA) U$1.4(INB)
TPIPD_OUT: R2.1 TP2.1(TP) U$1.5(OUTB) U$1.7(OUTA)
Unconnected: U$1.1(NC*1) U$1.8(NC*2)

### Notes on the sheet
- PPU - Plasma Power Unit Module Version 8C

### Library data of the parts
BC1 BC3 = gwu_mpnl_ucat_v10:BYPASS-CAP-0.1UF; MF: AVX; MPN: 06123C104KAT2A
BC2 BC4 = gwu_mpnl_ucat_v10:BYPASS-CAP-1UF; MF: AVX; MPN: 0612YC105KAT2A
C1 = samudra_ucat_v9:APSG200ELL681MJB5S; MF: United Chemi-Con; MPN: APSG200ELL681MJB5S
CT1 = GTEEL_gwu_mpnl_ucat_v10:MURATA-5600-CURR-XFR; MF: MURATA; MPN: 56050C
L1 = gwu_mpnl_ucat_v10:PPUV8-INDUCTOR-V2: GWU MpNL Custom Wound Inductor for PPUV8 1 x 1 Magnetics High Flux 58312A2 Core Winding: 18AWG Magnet Wire. Turns: See analysis report by HAQUE March 2015; MF: Magnetics; MPN: 59312-A2
Q11 = gwu_mpnl_ucat_v10:IXYH30N120C3D1; MF: IXYS; MPN: IXYH30N120C3D1
R1 = rcl:R-US_: RESISTOR, American symbol; MF: VISHAY/DALE; MPN: CRCW121015R0FKEAHP
R2 = rcl:R-US_: RESISTOR, American symbol; MF: VISHAY; MPN: PAT0805E1001BST1
SJ1 = jumper:SJ: SMD solder JUMPER; MF: VISHAY/DALE; MPN: CRCW08050000Z0EA
T1 = gwu_mpnl_ucat_v10:MCAT-SPADE-TERMINAL; MF: HARWIN; MPN: S4011-46
TP1-TP3 = gwu_mpnl_ucat_v10:PCB-MINI-SMD-TESTPOINT; MF: Keystone Electronics; MPN: 5015
U$1 = gwu_mpnl_ucat_v10:IXDN604; MF: IXYS; MPN: IXDN604SI

## Net classes
1 P18H-0.6A-CKT: width 0.203 mm
2 VOUTA-2A-CKT: width 1.016 mm
3 P3-0.5A-CKT: width 0.254 mm
4 TPOUT-0.25A-3MIL: width 0.076 mm
5 power: width 0.406 mm